# EAGLE board MAIN BOARD fat outline (EAGLE 5.11)
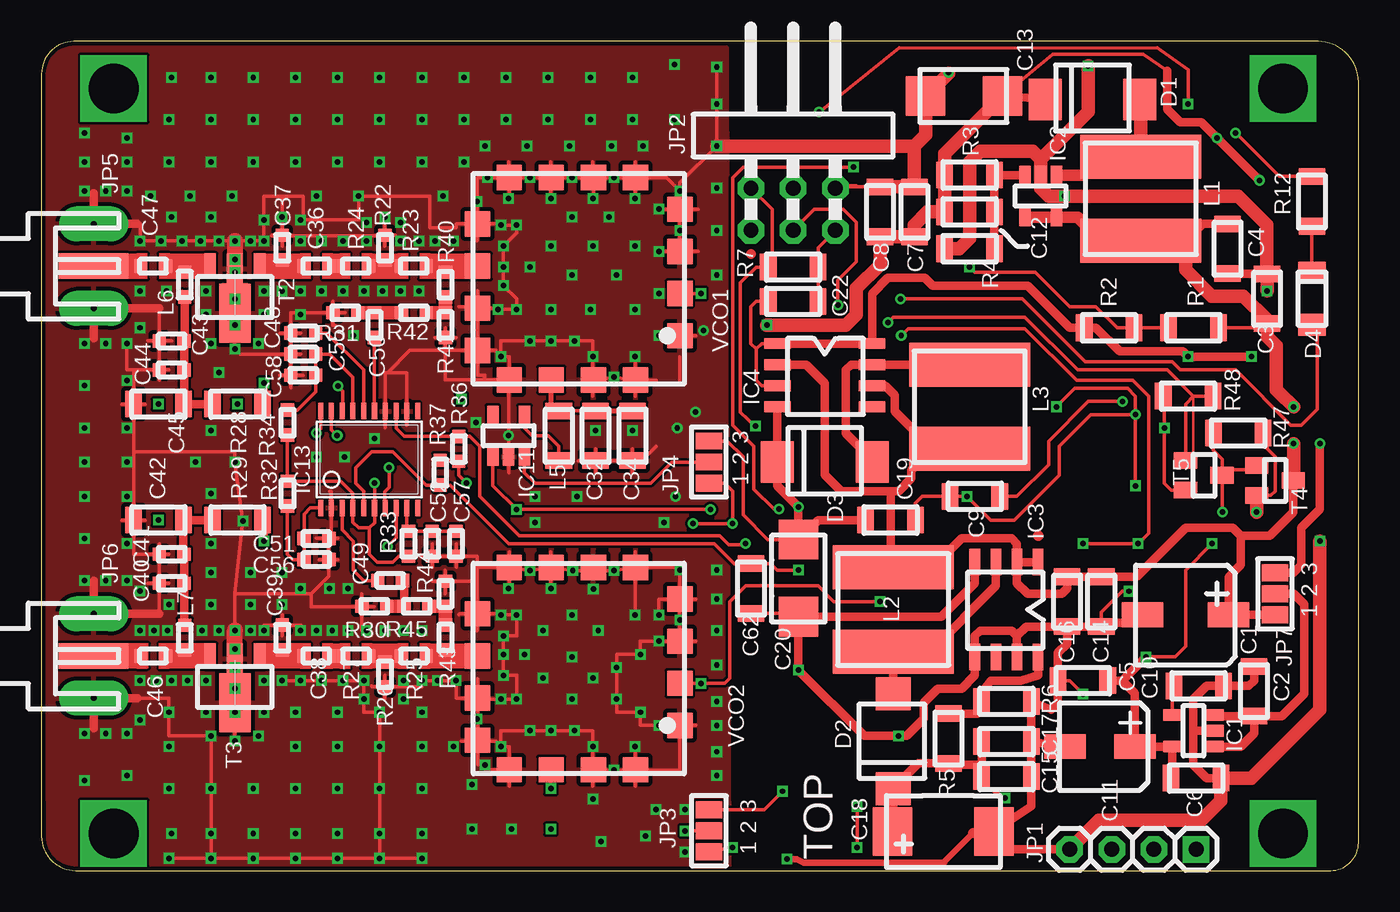
[diagram p2: board, top side]
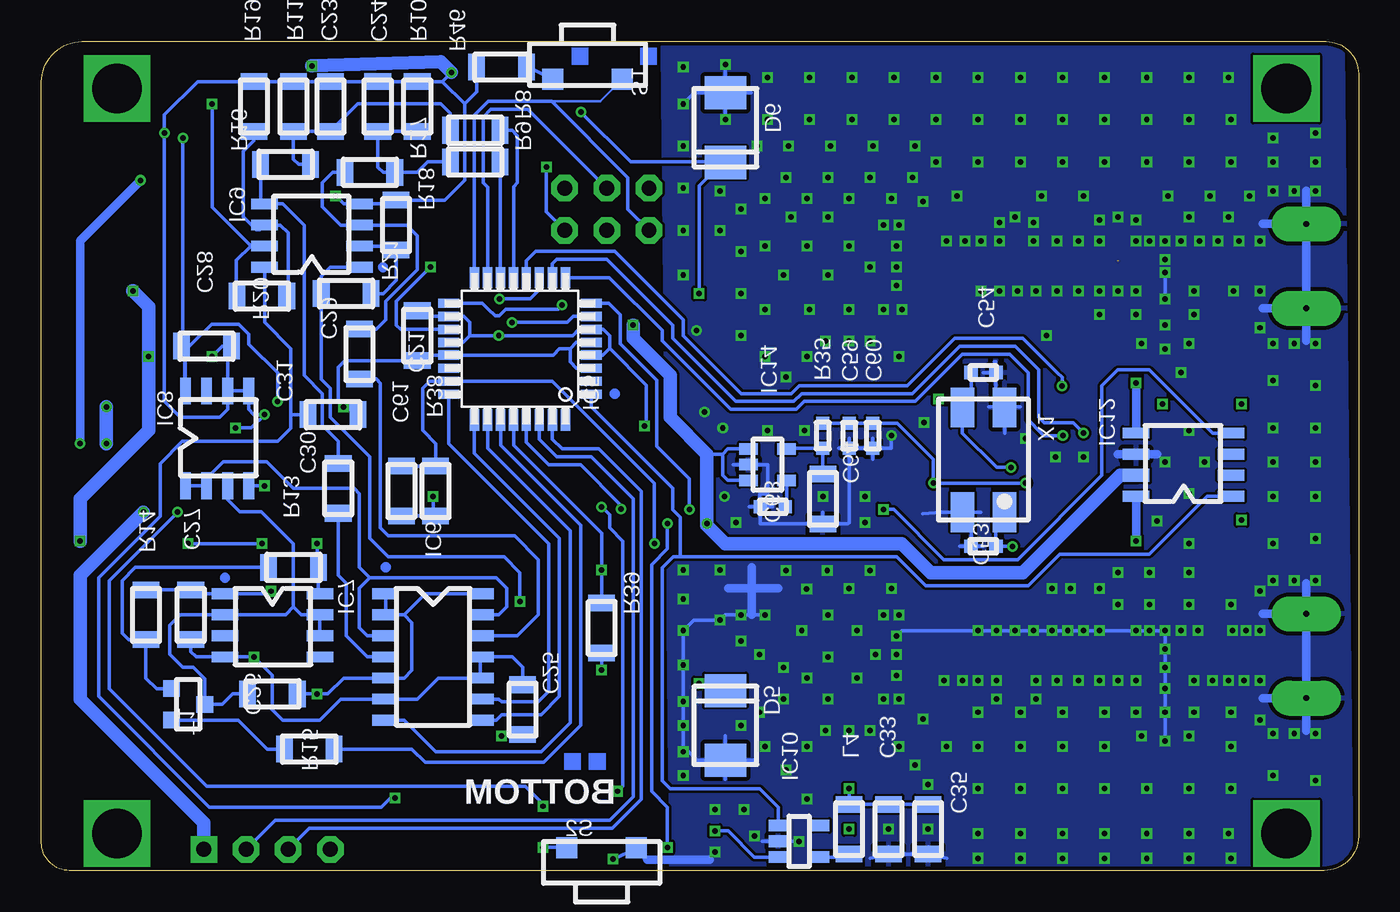
[diagram p3: board, bottom side, seen from below]

Size 79.39 x 49.97 mm. Coordinates in mm from the lower left corner, seen from the top.
Outline: 1.96,49.97 arc90 0,48.02 0,2.05 arc90 2.05,0 77.7,0 arc90 79.39,1.69 79.39,47.53 arc90 76.95,49.97 1.96,49.97
Copper layers (1*16): Top 0.035mm / dielectric 1.5mm / Bottom 0.035mm
Design rules "ITead_rule": minimum track width 6mil, minimum drill 12mil, track to track 6mil, track to pad 6mil, pad to pad 6mil, via to via 6mil, smd to smd 0mil, copper to edge 10mil, drill to drill 10mil, minimum pad ring 10mil, minimum via ring 6mil, stop-mask expansion 2mil, vias tented up to drill 100mil, thermal gap 10mil

## Footprints (pad centres in the part's own frame; a part is rotated, then mirrored left to right if it is on the bottom)
C1 = smd 1.5 x 2.5: 1 0,-2.594; 2 0,2.594
C2 = smd 1 x 1.6: 1 -1.5,0; 2 1.5,0
C3 = smd 1 x 1.6: 1 -1.5,0; 2 1.5,0
C4 = smd 1 x 1.6: 1 1.5,0; 2 -1.5,0
C5 = smd 1.6 x 1: 1 0,-1.5; 2 0,1.5
C6 = smd 1.6 x 1: 1 0,1.5; 2 0,-1.5
C7 = smd 1 x 1.6: 1 -1.5,0; 2 1.5,0
C8 = smd 1 x 1.6: 1 -1.5,0; 2 1.5,0
C9 = smd 1.6 x 1: 1 0,-1.5; 2 0,1.5
C10 = smd 1.6 x 1: 1 0,1.5; 2 0,-1.5
C11 = smd 1.5 x 2.5: 1 0,-1.865; 2 0,2.341
C12 = smd 1.6 x 1: 1 0,1.5; 2 0,-1.5
C13 = smd 2.388 x 2.388: 1 0,-2.311; 2 0,2.337
C14 = smd 1 x 1.6: 1 1.5,0; 2 -1.5,0
C15 = smd 1.6 x 1: 1 0,1.5; 2 0,-1.5
C16 = smd 1 x 1.6: 1 1.5,0; 2 -1.5,0
C17 = smd 1.6 x 1: 1 0,1.5; 2 0,-1.5
C18 = smd 2.896 x 2.388: 1 0,3.048; 2 0,-3.048
C19 = smd 1.6 x 1: 1 0,1.5; 2 0,-1.5
C20 = smd 2.388 x 2.388: 1 2.311,0; 2 -2.337,0
C21 = smd 1 x 1.6 bottom: 1 1.5,0; 2 -1.5,0
C22 = smd 1.6 x 1: 1 0,-1.5; 2 0,1.5
C23 = smd 1 x 1.6 bottom: 1 1.5,0; 2 -1.5,0
C24 = smd 1 x 1.6 bottom: 1 -1.5,0; 2 1.5,0
C25 = smd 1 x 1.6 bottom: 1 1.5,0; 2 -1.5,0
C26 = smd 1.6 x 1 bottom: 1 0,-1.5; 2 0,1.5
C27 = smd 1 x 1.6 bottom: 1 -1.5,0; 2 1.5,0
C28 = smd 1.6 x 1 bottom: 1 0,-1.5; 2 0,1.5
C29 = smd 1 x 1.6 bottom: 1 -1.5,0; 2 1.5,0
C30 = smd 1 x 1.6 bottom: 1 -1.5,0; 2 1.5,0
C31 = smd 1.6 x 1 bottom: 1 0,-1.5; 2 0,1.5
C32 = smd 1 x 1.6: 1 1.5,0; 2 -1.5,0
C33 = smd 1 x 1.6 bottom: 1 1.5,0; 2 -1.5,0
C34 = smd 1 x 1.6: 1 1.5,0; 2 -1.5,0
C35 = smd 1 x 1.6 bottom: 1 1.5,0; 2 -1.5,0
C36 = smd 0.8 x 0.8: 1 0,-0.75; 2 0,0.75
C37 = smd 0.8 x 0.8: 1 -0.75,0; 2 0.75,0
C38 = smd 0.8 x 0.8: 1 0,-0.75; 2 0,0.75
C39 = smd 0.8 x 0.8: 1 -0.75,0; 2 0.75,0
C40 = smd 0.8 x 0.8: 1 0,0.75; 2 0,-0.75
C41 = smd 0.8 x 0.8: 1 0,0.75; 2 0,-0.75
C42 = smd 1.6 x 1: 1 0,1.5; 2 0,-1.5
C43 = smd 0.8 x 0.8: 1 0,-0.75; 2 0,0.75
C44 = smd 0.8 x 0.8: 1 0,-0.75; 2 0,0.75
C45 = smd 1.6 x 1: 1 0,-1.5; 2 0,1.5
C46 = smd 0.8 x 0.8: 1 0,-0.75; 2 0,0.75
C47 = smd 0.8 x 0.8: 1 0,-0.75; 2 0,0.75
C48 = smd 0.8 x 0.8: 1 0,0.75; 2 0,-0.75
C49 = smd 0.8 x 0.8: 1 0,-0.75; 2 0,0.75
C50 = smd 0.8 x 0.8: 1 0.75,0; 2 -0.75,0
C51 = smd 0.8 x 0.8: 1 0,-0.75; 2 0,0.75
C52 = smd 0.8 x 0.8: 1 -0.75,0; 2 0.75,0
C53 = smd 0.8 x 0.8 bottom: 1 0,0.75; 2 0,-0.75
C54 = smd 0.8 x 0.8 bottom: 1 0,0.75; 2 0,-0.75
C55 = smd 0.8 x 0.8: 1 0,0.75; 2 0,-0.75
C56 = smd 0.8 x 0.8: 1 0,-0.75; 2 0,0.75
C57 = smd 0.8 x 0.8: 1 -0.75,0; 2 0.75,0
C58 = smd 0.8 x 0.8: 1 0,0.75; 2 0,-0.75
C59 = smd 0.8 x 0.8 bottom: 1 -0.75,0; 2 0.75,0
C60 = smd 0.8 x 0.8 bottom: 1 -0.75,0; 2 0.75,0
C61 = smd 1 x 1.6 bottom: 1 1.5,0; 2 -1.5,0
C62 = smd 1 x 1.6: 1 1.5,0; 2 -1.5,0
C63 = smd 0.8 x 0.8 bottom: 1 0,-0.75; 2 0,0.75
C64 = smd 1 x 1.6 bottom: 1 1.5,0; 2 -1.5,0
D1 = smd 2.5 x 2: 1 0,-2.856; 2 0,2.859
D2 = smd 2 x 2.1: 1 2.856,0; 2 -2.859,0
D3 = smd 2.5 x 2: 1 0,-2.856; 2 0,2.859
D4 = smd 1.315 x 1.68: 1 -1.568,0; 2 1.568,0
D5 = smd 2 x 2.5 bottom: 1 -2.1,0; 2 2.1,0
D6 = smd 2 x 2.5 bottom: 1 2.1,0; 2 -2.1,0
IC1 = smd 0.7 x 1.1: 1 -0.953,-1.27; 2 -0.001,-1.27; 3 0.951,-1.27; 4 0.952,1.27; 5 -0.954,1.27
IC2 = smd 1.1 x 0.7: 1 1.27,-0.953; 2 1.27,-0.001; 3 1.27,0.951; 4 -1.27,0.952; 5 -1.27,-0.954
IC3 = smd 1.6 x 0.65: 1 0,0; 2 0,1.27; 3 0,2.54; 4 0,3.81; 5 -5.715,3.81; 6 -5.715,2.54; 7 -5.715,1.27; 8 -5.715,0
IC4 = smd 0.65 x 1.6: 1 0,0; 2 -1.27,0; 3 -2.54,0; 4 -3.81,0; 5 -3.81,-5.715; 6 -2.54,-5.715; 7 -1.27,-5.715; 8 0,-5.715
IC5 = smd 0.559 x 1.27 bottom: 1 -2.743,4.293; 2 -1.956,4.293; 3 -1.168,4.293; 4 -0.381,4.293; 5 0.381,4.293; 6 1.168,4.293; 7 1.956,4.293; 8 2.743,4.293; 17 2.743,-4.293; 18 1.956,-4.293; 19 1.168,-4.293; 20 0.381,-4.293; 21 -0.381,-4.293; 22 -1.168,-4.293; 23 -1.956,-4.293; 24 -2.743,-4.293 | smd 1.27 x 0.559 bottom: 9 4.293,2.743; 10 4.293,1.956; 11 4.293,1.168; 12 4.293,0.381; 13 4.293,-0.381; 14 4.293,-1.168; 15 4.293,-1.956; 16 4.293,-2.743; 25 -4.293,-2.743; 26 -4.293,-1.956; 27 -4.293,-1.168; 28 -4.293,-0.381; 29 -4.293,0.381; 30 -4.293,1.168; 31 -4.293,1.956; 32 -4.293,2.743
IC6 = smd 0.65 x 1.6 bottom: 1 0,0; 2 -1.27,0; 3 -2.54,0; 4 -3.81,0; 5 -5.08,0; 6 -6.35,0; 7 -7.62,0; 8 -7.62,5.715; 9 -6.35,5.715; 10 -5.08,5.715; 11 -3.81,5.715; 12 -2.54,5.715; 13 -1.27,5.715; 14 0,5.715
IC7 = smd 0.65 x 1.6 bottom: 1 0,0; 2 -1.27,0; 3 -2.54,0; 4 -3.81,0; 5 -3.81,5.715; 6 -2.54,5.715; 7 -1.27,5.715; 8 0,5.715
IC8 = smd 1.6 x 0.65 bottom: 1 0,0; 2 0,1.27; 3 0,2.54; 4 0,3.81; 5 5.715,3.81; 6 5.715,2.54; 7 5.715,1.27; 8 5.715,0
IC9 = smd 0.65 x 1.6 bottom: 1 0,0; 2 1.27,0; 3 2.54,0; 4 3.81,0; 5 3.81,-5.715; 6 2.54,-5.715; 7 1.27,-5.715; 8 0,-5.715
IC10 = smd 0.7 x 1.1 bottom: 1 0.953,-1.27; 2 0.001,-1.27; 3 -0.951,-1.27; 4 -0.952,1.27; 5 0.954,1.27
IC11 = smd 1.1 x 0.7: 1 -1.27,0.953; 2 -1.27,0.001; 3 -1.27,-0.951; 4 1.27,-0.952; 5 1.27,0.954
IC12 = smd 0.65 x 1.6 bottom: 1 0,0; 2 1.27,0; 3 2.54,0; 4 3.81,0; 5 3.81,-5.715; 6 2.54,-5.715; 8 0,-5.715 | smd 0.8 x 1.6 bottom: 7 1.27,-5.715
TSSOP20 = smd 0.305 x 0.991: 1 -2.925,-2.918; 2 -2.275,-2.918; 3 -1.625,-2.918; 4 -0.975,-2.918; 5 -0.325,-2.918; 6 0.325,-2.918; 7 0.975,-2.918; 8 1.625,-2.918; 9 2.275,-2.918; 10 2.925,-2.918; 11 2.925,2.918; 12 2.275,2.918; 13 1.625,2.918; 14 0.975,2.918; 15 0.325,2.918; 16 -0.325,2.918; 17 -0.975,2.918; 18 -1.625,2.918; 19 -2.275,2.918; 20 -2.925,2.918
IC14 = smd 0.7 x 1.1 bottom: 1 0.95,-1.15; 2 0.001,-1.15; 3 -0.95,-1.15; 4 -0.95,1.15; 5 0.95,1.15
JP1 = drill 0.9 pad 1.6 square: 1 0,0 | drill 0.9 pad 1.6 octagon: 2 0,2.54; 3 0,5.08; 4 0,7.62
JP2 = drill 0.9 pad 1.6 octagon: 1 0,0; 2 2.54,0; 3 0,-2.54; 4 2.54,-2.54; 5 0,-5.08; 6 2.54,-5.08
JP3 = smd 1.016 x 1.6: 1 -1.27,0; 2 0,0; 3 1.27,0
JP4 = smd 1.016 x 1.6: 1 -1.27,0; 2 0,0; 3 1.27,0
JP5 = drill 0.356 pad 2.096 long: 1 -2.54,-2.286; 3 2.54,-2.286 | smd 1.524 x 4.191: 2 0,-2.286
JP7 = smd 1.016 x 1.6: 1 -1.27,0; 2 0,0; 3 1.27,0
L1 = smd 2.65 x 7.3: 1 0,0; 2 5.08,0
L2 = smd 2.65 x 7.3: 1 0,0; 2 -5.08,0
L3 = smd 2.65 x 7.3: 1 0,0; 2 5.08,0
L4 = smd 1 x 1.6 bottom: 1 1.5,0; 2 -1.5,0
L5 = smd 1 x 1.6: 1 1.5,0; 2 -1.5,0
L6 = smd 0.8 x 0.8: 1 0.75,0; 2 -0.75,0
L7 = smd 0.8 x 0.8: 1 -0.75,0; 2 0.75,0
R1 = smd 1.6 x 1: 1 0,-1.5; 2 0,1.5
R2 = smd 1.6 x 1: 1 0,-1.5; 2 0,1.5
R3 = smd 1.6 x 1: 1 0,1.5; 2 0,-1.5
R4 = smd 1.6 x 1: 1 0,-1.5; 2 0,1.5
R5 = smd 1 x 1.6: 1 -1.5,0; 2 1.5,0
R6 = smd 1.6 x 1: 1 0,1.5; 2 0,-1.5
R7 = smd 1.6 x 1: 1 0,1.5; 2 0,-1.5
R8 = smd 1.6 x 1 bottom: 1 0,1.5; 2 0,-1.5
R9 = smd 1.6 x 1 bottom: 1 0,1.5; 2 0,-1.5
R10 = smd 1 x 1.6 bottom: 1 -1.5,0; 2 1.5,0
R11 = smd 1 x 1.6 bottom: 1 1.5,0; 2 -1.5,0
R12 = smd 1 x 1.6: 1 1.5,0; 2 -1.5,0
R13 = smd 1.6 x 1 bottom: 1 0,1.5; 2 0,-1.5
R14 = smd 1 x 1.6 bottom: 1 -1.5,0; 2 1.5,0
R15 = smd 1.6 x 1 bottom: 1 0,1.5; 2 0,-1.5
R16 = smd 1.6 x 1 bottom: 1 0,-1.5; 2 0,1.5
R17 = smd 1.6 x 1 bottom: 1 0,-1.5; 2 0,1.5
R18 = smd 1 x 1.6 bottom: 1 -1.5,0; 2 1.5,0
R19 = smd 1 x 1.6 bottom: 1 -1.5,0; 2 1.5,0
R20 = smd 1.6 x 1 bottom: 1 0,-1.5; 2 0,1.5
R21 = smd 1.6 x 1 bottom: 1 0,-1.5; 2 0,1.5
R22 = smd 0.8 x 0.8: 1 -0.75,0; 2 0.75,0
R23 = smd 0.8 x 0.8: 1 0,-0.75; 2 0,0.75
R24 = smd 0.8 x 0.8: 1 0,-0.75; 2 0,0.75
R25 = smd 0.8 x 0.8: 1 0,0.75; 2 0,-0.75
R26 = smd 0.8 x 0.8: 1 0.75,0; 2 -0.75,0
R27 = smd 0.8 x 0.8: 1 0,0.75; 2 0,-0.75
R28 = smd 1.6 x 1: 1 0,1.5; 2 0,-1.5
R29 = smd 1.6 x 1: 1 0,1.5; 2 0,-1.5
R30 = smd 0.8 x 0.8: 1 0,-0.75; 2 0,0.75
R31 = smd 0.8 x 0.8: 1 0,-0.75; 2 0,0.75
R32 = smd 0.8 x 0.8: 1 0.75,0; 2 -0.75,0
R33 = smd 0.8 x 0.8: 1 -0.75,0; 2 0.75,0
R34 = smd 0.8 x 0.8: 1 -0.75,0; 2 0.75,0
R35 = smd 0.8 x 0.8 bottom: 1 0.75,0; 2 -0.75,0
R36 = smd 0.8 x 0.8: 1 -0.75,0; 2 0.75,0
R37 = smd 0.8 x 0.8: 1 0.75,0; 2 -0.75,0
R38 = smd 1 x 1.6 bottom: 1 1.5,0; 2 -1.5,0
R39 = smd 1 x 1.6 bottom: 1 1.5,0; 2 -1.5,0
R40 = smd 0.8 x 0.8: 1 -0.75,0; 2 0.75,0
R41 = smd 0.8 x 0.8: 1 0.75,0; 2 -0.75,0
R42 = smd 0.8 x 0.8: 1 0,0.75; 2 0,-0.75
R43 = smd 0.8 x 0.8: 1 0.75,0; 2 -0.75,0
R44 = smd 0.8 x 0.8: 1 -0.75,0; 2 0.75,0
R45 = smd 0.8 x 0.8: 1 0,0.75; 2 0,-0.75
R46 = smd 1.6 x 1 bottom: 1 0,1.5; 2 0,-1.5
R47 = smd 1.6 x 1: 1 0,1.5; 2 0,-1.5
R48 = smd 1.6 x 1: 1 0,-1.5; 2 0,1.5
S1 = smd 1.27 x 1.27 bottom: 1 -0.885,2.1; 2 -0.885,-2.1
S2 = smd 1.27 x 1.27 bottom: 1 0.885,-2.1; 2 0.885,2.1
T1 = smd 1 x 1 bottom: 1 0.95,-1; 2 -0.95,-1; 3 0,1
T2 = smd 1.524 x 0.711: 1 2.2,-1.5; 3 2.2,1.5 | smd 1.85 x 0.965: 2 2.037,0 | smd 3.556 x 1.905: 4 -0.635,0
T3 = smd 1.524 x 0.711: 1 2.2,-1.5; 3 2.2,1.5 | smd 1.85 x 0.965: 2 2.037,0 | smd 3.556 x 1.905: 4 -0.635,0
T4 = smd 1 x 1.4: 1 0.9,1.111; 2 -0.9,1.111; 3 0,-1.089
T5 = smd 1 x 1.4: 1 0.9,1.111; 2 -0.9,1.111; 3 0,-1.089
VCO1 = smd 1.524 x 1.524: 1 0,0; 2 2.54,0; 3 5.08,0; 4 7.62,0; 5 9.525,2.667; 6 9.525,5.207; 7 9.525,7.747; 8 9.525,10.287; 9 6.731,12.192; 10 4.191,12.192; 11 1.651,12.192; 12 -0.889,12.192; 13 -2.667,10.287; 14 -2.667,7.747; 15 -2.667,5.207; 16 -2.667,2.667
VCO2 = smd 1.524 x 1.524: 1 0,0; 2 2.54,0; 3 5.08,0; 4 7.62,0; 5 9.525,2.667; 6 9.525,5.207; 7 9.525,7.747; 8 9.525,10.287; 9 6.731,12.192; 10 4.191,12.192; 11 1.651,12.192; 12 -0.889,12.192; 13 -2.667,10.287; 14 -2.667,7.747; 15 -2.667,5.207; 16 -2.667,2.667
X1 = smd 2.4 x 1.4 bottom: 1 0,0; 2 0,-2.54; 3 6.3,-2.54; 4 6.3,0

## Placement (x,y rotation side)
C1  100u/6.3V  [C1]  68.96,15.41 90 top
C2  100n  [C2]  73.09,10.81 90 top
C3  100n  [C3]  73.88,34.46 90 top
C4  1u  [C4]  71.5,37.48 90 top
C5  1u  [C5]  62.77,11.45 90 top
C6  100n  [C6]  69.6,5.57 90 top
C7  100n  [C7]  52.61,39.7 90 top
C8  1u  [C8]  50.55,39.7 90 top
C9  100n  [C9]  56.26,22.56 90 top
C10  10n  [C10]  69.76,11.13 90 top
C11  100u/4V  [C11]  64.04,7.48 90 top
C12  470p  [C12]  55.95,39.7 90 top
C13  100u/10V  [C13]  55.63,46.69 90 top
C14  1u  [C14]  63.88,16.21 90 top
C15  1u  [C15]  58.17,5.65 90 top
C16  100n  [C16]  61.82,16.21 90 top
C17  100n  [C17]  58.17,7.78 90 top
C18  22u/35V  [C18]  54.36,2.35 90 top
C19  100n  [C19]  51.18,21.13 90 top
C20  68u/16V  [C20]  45.63,17.64 90 top
C21  100n  [C21]  56.74,32.24 90 top
C22  100n  [C22]  45.31,34.3 90 top
C23  4.7u  [C23]  61.98,46.05 90 top
C24  4.7u  [C24]  59.12,46.05 90 top
C25  100n  [C25]  50.39,9.7 90 top
C26  100n  [C26]  65.47,10.65 90 top
C27  100n  [C27]  70.39,15.41 90 top
C28  100n  [C28]  69.44,31.61 90 top
C29  4.7u  [C29]  60.23,31.13 90 top
C30  4.7u  [C30]  61.5,23.03 90 top
C31  100n  [C31]  61.82,27.48 90 top
C32  100n  [C32]  33.4,26.21 90 top
C33  100n  [C33]  28.32,2.49 90 top
C34  1u  [C34]  35.62,26.21 90 top
C35  1u  [C35]  25.94,2.49 90 top
C36  68p  [C36]  16.57,36.43 90 top
C37  *  [C37]  14.51,37.54 90 top
C38  100p  [C38]  16.57,12.94 90 top
C39  *  [C39]  14.51,14.04 90 top
C40  68p  [C40]  7.84,17.32 90 top
C41  1000p  [C41]  7.84,19.07 90 top
C42  1u  [C42]  7.05,21.13 90 top
C43  22p  [C43]  7.84,31.92 90 top
C44  1000p  [C44]  7.84,30.18 90 top
C45  1u  [C45]  7.05,28.11 90 top
C46  100p  [C46]  6.73,12.94 90 top
C47  68p  [C47]  6.73,36.43 90 top
C48  100p  [C48]  15.78,32.4 90 top
C49  100p  [C49]  21.02,17.48 90 top
C50  100p  [C50]  20.07,32.88 90 top
C51  100p  [C51]  16.57,20.02 90 top
C52  100p  [C52]  23.56,19.7 90 top
C53  22p  [C53]  22.61,19.54 90 top
C54  22p  [C54]  22.61,30.02 90 top
C55  100p  [C55]  15.78,31.13 90 top
C56  10n  [C56]  16.57,18.75 90 top
C57  10n  [C57]  24.99,19.7 90 top
C58  10n  [C58]  15.78,29.86 90 top
C59  100n  [C59]  30.7,26.21 90 top
C60  1u  [C60]  29.27,26.21 90 top
C61  100n  [C61]  57.69,22.88 90 top
C62  100n  [C62]  42.77,17 90 top
C63  10n  [C63]  35.31,21.92 90 top
C64  1u  [C64]  32.29,22.4 90 top
D1  SS14  [D1]  63.36,46.49 90 top
D2  SS14  [D2]  51.34,7.79 90 top
D3  SS14  [D3]  47.21,24.62 90 top
D4  GREEN  [D4]  76.58,34.46 90 top
D5  SMAZ22-13-F  [D5]  38.16,8.75 90 top
D6  SMAZ22-13-F  [D6]  38.16,44.78 90 top
IC1  TPS79333  [IC1]  69.44,8.43 90 top
IC2  LM2731Y  [IC2]  60.23,40.66 90 top
IC3  LT1173CS8  [IC3]  60.07,18.59 90 top
IC4  LT1301CS8  [IC4]  44.36,31.77 90 top
IC5  ATMEGA168-10V  [IC5]  50.55,31.45 90 top
IC6  AD8402ARZ10  [IC6]  58.64,16.68 90 top
IC7  NE555D  [IC7]  68.33,16.68 90 top
IC8  LM358D  [IC8]  70.71,23.19 90 top
IC9  LM358D  [IC9]  60.23,36.37 90 top
IC10  MIC2514  [IC10]  33.72,1.76 90 top
IC11  MIC2514  [IC11]  28.16,26.21 90 top
IC12  MIC2506YM  [IC12]  7.69,22.56 90 top
IC13  LMX2433  [TSSOP20]  19.75,24.78 0 top
IC14  LP2985AIM5-2.5CT  [IC14]  35.62,24.46 90 top
JP1  USB/Batt Board  [JP1]  69.6,1.28 90 top
JP2  ISP  [JP2]  42.77,38.59 90 top
JP3  VCO voltage select  [JP3]  40.23,2.4 90 top
JP4  VCO Voltage select  [JP4]  40.23,24.62 90 top
JP5  SMA J629-ND  [JP5]  0.86,36.43 90 top
JP6  SMA J629-ND  [JP5]  0.86,12.94 90 top
JP7  3.3V supply select  [JP7]  74.36,16.68 90 top
L1  7.3uH  [L1]  66.26,37.96 90 top
L2  33uH  [L2]  51.34,18.27 90 top
L3  33uH  [L3]  55.95,25.41 90 top
L4  FERRIT  [L4]  30.7,2.49 90 top
L5  FERRIT  [L5]  31.18,26.21 90 top
L6  22nH  [L6]  8.64,35.32 90 top
L7  33nH  [L7]  8.64,14.04 90 top
R1  510K  [R1]  69.44,32.72 90 top
R2  330K  [R2]  64.36,32.72 90 top
R3  47K  [R3]  55.95,41.92 90 top
R4  13K  [R4]  55.95,37.48 90 top
R5  820K  [R5]  54.67,7.95 90 top
R6  50K  [R6]  58.17,10.2 90 top
R7  10K  [R7]  45.31,36.37 90 top
R8  1K  [R8]  53.25,44.62 90 top
R9  1K  [R9]  53.25,42.72 90 top
R10  *  [R10]  56.74,46.05 90 top
R11  *  [R11]  64.2,46.05 90 top
R12  750  [R12]  76.58,40.34 90 top
R13  10K  [R13]  64.2,18.27 90 top
R14  20K  [R14]  73.09,15.41 90 top
R15  68  [R15]  63.25,7.32 90 top
R16  10K  [R16]  64.68,42.56 90 top
R17  10K  [R17]  59.6,42.08 90 top
R18  10K  [R18]  58.01,38.91 90 top
R19  10K  [R19]  66.58,46.05 90 top
R20  30K(47K)  [R20]  66.11,34.62 90 top
R21  30K(47K)  [R21]  61.02,34.78 90 top
R22  *  [R22]  20.7,37.54 90 top
R23  0  [R23]  22.45,36.43 90 top
R24  0  [R24]  18.96,36.43 90 top
R25  0  [R25]  22.45,12.94 90 top
R26  *  [R26]  20.7,11.82 90 top
R27  0  [R27]  18.96,12.94 90 top
R28  1  [R28]  11.81,28.11 90 top
R29  1  [R29]  11.81,21.13 90 top
R30  50  [R30]  20.07,15.93 90 top
R31  50  [R31]  18.32,33.62 90 top
R32  18  [R32]  14.83,22.72 90 top
R33  18  [R33]  22.13,19.7 90 top
R34  18  [R34]  14.83,27 90 top
R35  18  [R35]  32.29,26.21 90 top
R36  10K  [R36]  25.15,25.41 90 top
R37  10K  [R37]  24.04,23.99 90 top
R38  10K  [R38]  55.63,22.88 90 top
R39  10K  [R39]  45.63,14.62 90 top
R40  10  [R40]  24.35,35.32 90 top
R41  120  [R41]  24.35,32.88 90 top
R42  10  [R42]  22.45,33.62 90 top
R43  22  [R43]  24.35,14.04 90 top
R44  47  [R44]  24.35,16.68 90 top
R45  22  [R45]  22.61,15.93 90 top
R46  100  [R46]  51.66,48.43 90 top
R47  100K  [R47]  72.14,26.37 90 top
R48  100K  [R48]  69.12,28.59 90 top
S1  Cycle Program  [S1]  46.48,48.59 90 top
S2  Power ON  [S2]  45.63,0.49 90 top
T1  MMBT3906  [T1]  70.55,10.02 90 top
T2  GALI-84 / SGA-7489Z  [T2]  11.65,34.23 90 top
T3  GALI-84 / SGA-7489Z  [T3]  11.65,10.74 90 top
T4  FDN302P  [T4]  74.36,23.51 90 top
T5  FDV303N  [T5]  70.07,23.83 90 top
VCO1  ROS-2700-1819  [VCO1]  38.48,32.24 90 top
VCO2  ROS-1300  [VCO2]  38.48,8.75 90 top
X1  10MHz  [X1]  21.34,21.61 90 top

## Tracks (layer width: path | path; a pad name or v marks a point on that pad's centre or on a via)
1  (via drill 0.33 pad 0.25)
  Top 0.2: T4.2 74.09,22.61 74.36,22.88 74.36,24.94 73.88,25.41 73.88,26.12 R47.2
  Top 0.8: v73.25,21.61 T4.2
  Bottom 0.8: JP1.1 69.6,2.87 77.06,10.33 77.06,17.8 v73.25,21.61
2
  Top 0.5: 63.88,43.04 L1.2 | 66.26,46.69 D1.1
  Top 0.7: IC2.1 62.77,41.92 63.88,43.04
  Top 0.8: L1.2 66.26,46.69
3
  Bottom 0.2: JP1.3 63.25,2.56 44.99,2.56 43.24,4.3 43.24,22.88 45.78,25.41 48.01,25.41 48.59,26 IC5.31
3.3V  (via drill 0.33)
  Top 0.2: v62.77,19.7 v66.11,19.7 66.74,20.34 66.74,28.59 65.79,29.54 62.39,29.54 59.28,32.66 52.24,32.66 v51.83,32.24 | v70.55,19.7 68.96,18.11 68.96,13.51 IC7.4 v66.58,12.87 | JP2.2 44.04,39.86 44.04,36.6 R7.1 43.09,36.37 42.13,35.42 42.13,27.63 v43.03,26.79
  Top 0.5: C6.1 68.17,5.64 IC1.5 C11.1 65.91,10.69 65.15,11.45 | 65.15,11.45 C5.1 | v66.58,12.87 65.15,11.45
  Bottom 0.2: IC5.4 45.56,31.07 45.15,31.48 | 45.15,31.48 45.15,32.24 45.52,32.62 IC5.6 47,32.62 47.37,32.24 v51.83,32.24 53.56,32.24 | IC5.20 53.98,31.83 53.56,32.24 | 53.56,32.24 53.56,33.04 53.93,33.4 IC5.18 56.4,33.4 C21.1 | v62.77,19.7 62.77,18.34 R13.1 62.7,16.77 IC7.8 | v70.55,19.7 v66.11,19.7 | C25.1 50.39,12.24 51.02,12.87 IC6.11 IC6.10 55.47,11.6 56.74,10.33 IC6.6 61.34,10.33 62.61,9.06 64.84,9.06 65.47,9.7 65.47,11.76 v66.58,12.87 IC7.4 70.07,12.87 70.39,13.19 C27.1 | 45.15,31.48 42.93,29.26 42.93,26.89 v43.03,26.79
  Bottom 0.5: IC5.20
5V  (via drill 0.33, 0.33 pad 0.25)
  Top 0.2: v65.15,28.27 63.09,28.27 60.71,25.89 60.71,24.46 58.8,22.56 C9.1 | JP4.1 41.18,23.35 41.66,22.88 v41.66,20.91 v39.28,20.91 | v41.66,1.39 JP3.1 | C13.1 60.95,49.2 66.42,49.2 67.85,48.22
  Top 0.5: v77.06,25.73 77.06,21.76 75.95,20.65 75.95,18.43 75.47,17.95 JP7.3 | C13.1 D1.2 | 67.85,48.22 67.85,45.89 68.64,45.1 69.91,45.1 v70.87,44.15 v73.41,41.61
  Top 0.8: v43.72,32.88 48.48,32.88 49.12,33.51 49.12,35.1 50.55,36.53 C8.1 C7.1 52.61,38.91 53.41,39.7 C12.1 R3.1 54.45,43.19 C13.1
  Bottom 0.2: IC14.3 38.01,23.51 38.32,23.83 38.32,25.1 | 38.32,25.1 38.01,25.41 IC14.1 | 39.28,25.1 38.32,25.1 | v41.66,20.91 41.66,19.38 42.61,18.43 42.61,4.78 41.66,3.83 v41.66,1.39 | 70.94,44.08 v70.87,44.15 70.87,32.31 70.74,32.18 70.74,28.94 IC8.8 70.71,31.36 70.47,31.61 | v65.15,28.27 65.15,30 66.89,31.73 66.89,32.33 67.49,32.93 69.14,32.93 70.47,31.61 | 70.47,31.61 C28.1
  Bottom 0.5: v77.06,25.73 77.06,37.96 v73.41,41.61
  Bottom 0.8: v43.72,32.88 43.72,32.08 41.5,29.86 41.5,27.32 39.28,25.1 v39.28,20.91 39.28,20.81 38.16,19.7 27.53,19.7 25.78,17.95 20.23,17.95 14.35,23.83 IC12.7
12V  (via drill 0.33)
  Top 0.2: C20.1 43.79,19.95 42.29,21.45 42.29,24.94 41.34,25.89 JP4.3 | v44.67,4.78 43.56,3.67 JP3.3
  Top 0.5: IC4.4 D3.2 44.35,23.19 v45.63,21.92 C20.1 46.81,21.13 C19.1
  Bottom 0.2: v45.63,21.92 45.15,21.45 45.15,20.65 44.36,19.86 44.36,5.1 v44.67,4.78
24V  (via drill 0.33)
  Top 0.2: v58.09,4.38 56.74,5.18 C15.1
  Top 0.5: 56.67,6.37 C15.1 | C18.1 51.34,1.63 D2.2 52.86,6.45 R5.1 54.76,6.37 56.67,6.37 | 56.67,6.37 C17.1
  Bottom 0.2: 64.36,27.48 C31.1 | 64.36,27.48 64.36,31.45 65.95,33.04 IC9.8 | v58.09,4.38 58.35,4.38 58.9,3.82 69.28,3.83 75.95,10.49 75.95,17.64 72.24,21.34 72.24,24.53 70.89,25.88 65.14,25.88 64.36,26.66 64.36,27.48
+
  Bottom 0.2: C30.2 61.5,25.89 62.45,26.84 62.45,28.75 63.56,29.86 63.56,38.91 64.84,40.18 IC9.5 66.18,40.41 R16.1
BYPASS
  Top 0.2: IC1.4 68.17,11.04 C10.1
CLK
  Bottom 0.2: IC6.9 51.82,10.33 51.66,10.18 49.44,10.18 48.8,10.81 48.8,19.7 54.84,25.74 IC5.24
CPOUTRF  (via drill 0.33)
  Top 0.2: IC13.13 21.38,26.65 21.86,26.16 R36.2 25.83,26.16 26.42,25.57 26.42,22.56 28.8,20.18 40.9,20.18 41.44,19.63 42.38,19.63 v42.45,19.7
  Bottom 0.2: C61.1 R38.1 55.63,25.73 56.42,26.53 56.42,29.07 56,29.49 IC5.23 48.59,29.49 42.45,23.35 v42.45,19.7
CS  (1 unrouted)
  Bottom 0.2: IC6.7 57.53,9.06 55.63,7.16 49.28,7.16 47.53,8.9 47.53,20.49 52.5,25.47 IC5.26
CTLA
  Bottom 0.2: IC5.1 46.26,27.95 41.34,23.03 41.34,21.73 40.89,21.28 40.89,18.91 | IC10.1 34.99,3.83 36.1,4.94 41.5,4.94 41.98,5.41 41.98,18.25 41.32,18.91 40.89,18.91 | IC12.1 9.11,22.56 12.61,19.07 18,19.07 19.91,17.16 26.1,17.16 27.85,18.91 40.89,18.91
  Bottom 0.406: IC10.1
CTLB  (via drill 0.33)
  Top 0.2: v40.33,21.76 v28.64,21.76 27.21,23.19 IC11.1
  Bottom 0.2: IC5.8 45.19,34.19 44.52,33.51 44.52,31.77 42.29,29.54 42.29,25.57 40.33,23.61 v40.33,21.76 | IC12.4 8.8,26.37 12.61,30.18 14.51,30.18 15.46,29.22 15.46,23.83 20.54,18.75 24.99,18.75 28,21.76 v28.64,21.76
DATA  (via drill 0.33)
  Top 0.2: v16.57,26.37 16.82,26.62 IC13.20
  Bottom 0.2: IC5.10 48.59,36.58 48.32,36.84 45.31,36.84 41.34,32.88 41.34,32.08 37.53,28.27 34.04,28.27 33.56,28.75 26.89,28.75 24.04,31.61 20.7,31.61 19.27,30.18 19.27,27.32 18.96,27 17.21,27 v16.57,26.37
  Bottom 0.5: IC5.10
FB
  Top 0.5: R4.1 C12.2 R3.2 IC2.3
FINRF#
  Top 0.2: IC13.16 19.43,30.18 17.21,32.4 C48.2
G  (via drill 0.33, 0.33 pad 0.25)
  Top 0.2: 73.32,24.48 T4.1 72.98,24.14 71.48,24.14 T5.3 71.19,23.8 | v49.16,1.39 v49.16,3.88 | v71.19,21.61 71.19,23.63 71.19,23.8 | 71.19,23.8 71.19,24.78 70.64,25.33 R47.1
  Top 0.406: T5.3 71.16,23.63 71.19,23.63
  Bottom 0.2: S2.1 47.79,1.44 47.84,1.39 v49.16,1.39 | v71.19,21.61 75.31,17.48 75.31,10.97 69.44,5.1 50.23,5.1 49.16,4.03 v49.16,3.88
GND  (via drill 0.33, 0.33 pad 0.25)
  Top 0.152: 54.43,0.47 54.43,0.54 | JP2.6 47.85,41.29 49.12,41.29 49.12,41.2
  Top 0.2: C19.2 52.68,22.15 53.09,22.56 C9.2 v55.79,22.56 57.21,21.13 58.64,21.13 61.34,23.83 61.34,25.57 63.25,27.48 v65.95,27.48 | IC4.1 43.4,31.77 43.09,31.45 | 43.09,31.45 43.09,29.54 43.4,29.22 IC4.3 | C62.2 45.42,15.5 C20.2 | v62.77,10.65 61.98,11.45 C5.2 | v65.95,27.48 v65.95,23.19 | 26.29,9.06 26.26,9.06 | v27.69,7.48 27.69,8.43 v29.43,8.43 v30.7,8.43 v32.13,8.43 33.24,8.43 v33.24,7.48 33.24,6.08 | 33.24,6.08 VCO2.15 33.24,6.05 | 35.82,6.05 VCO2.16 35.78,6.05 | 35.78,6.05 v34.51,6.05 33.24,6.05 | 35.78,6.05 v35.78,7.48 | 35.82,6.05 38.48,6.05 VCO2.1 | VCO2.1 v37.21,8.75 36.1,8.75 v36.1,9.54 34.67,9.54 v34.67,10.33 v34.67,12.24 34.67,13.03 v36.1,13.03 36.1,13.83 v37.21,13.83 VCO2.3 | VCO2.3 v38.48,15.1 VCO2.4 | 26.26,18.27 VCO2.8 | 30.7,18.27 v30.7,17 | VCO2.8 28.2,17 | 26.26,15.48 27.69,15.48 v27.69,15.41 v28.64,15.41 28.64,14.14 v27.85,14.14 v27.85,13.03 v27.85,11.76 28.64,11.76 v28.64,10.33 v27.69,10.33 26.42,10.33 | 35.78,18.27 v35.78,15.41 | VCO2.4 37.21,16.37 v37.21,15.41 | VCO2.5 35.78,18.59 | 26.29,32.56 VCO1.12 | VCO1.12 26.29,29.86 26.73,29.86 26.73,29.57 | 26.29,32.56 26.26,32.56 | 33.24,29.57 v33.24,30.97 33.24,31.92 v32.13,31.92 v30.7,31.92 v29.43,31.92 27.69,31.92 v27.69,30.97 28.2,30.97 VCO1.13 | 33.24,29.57 VCO1.15 33.24,29.54 | 35.82,29.54 VCO1.16 35.78,29.54 | 35.78,29.54 v34.51,29.74 33.24,29.54 | 35.78,29.54 v35.78,30.97 | 35.82,29.54 37.05,29.54 | 38.48,29.54 38.48,30.97 | v37.21,32.24 VCO1.1 39.44,32.24 | VCO1.3 v37.21,37.32 | VCO1.4 v38.48,38.59 VCO1.3 | VCO1.6 33.28,40.5 | 30.7,41.77 v30.7,40.5 | VCO1.8 28.2,40.5 v28.16,40.5 | 26.26,38.97 27.69,38.97 v27.69,38.91 v28.64,38.91 28.64,38.43 v27.85,37.64 v27.85,36.37 v27.85,35.26 28.64,34.46 v28.64,33.83 v27.53,33.83 27.53,33.89 VCO1.11
  Top 0.2: 35.78,41.77 v35.78,40.5 | VCO1.4 v37.21,39.86 | 35.78,42.08 VCO1.5 | 35.78,6.05 35.82,6.05 | 35.78,18.27 v34.51,18.07 v32.02,18.07 30.7,18.27 | 30.7,18.27 v29.43,18.07 VCO2.8 | 35.78,29.54 35.82,29.54 | VCO1.6 v34.51,41.77 35.78,41.77 | VCO1.8 v29.43,41.77 30.7,41.77 | 26.26,38.97 v26.26,40.34 26.26,41.77 v26.89,41.77 28.16,41.77 | IC11.2 | 28.16,29.54 27.69,29.07 | 37.05,25.57 36.19,24.71 C34.2 | C32.2 C34.2 | VCO2.11 26.2,10.49 | C32.2 33.4,25.41 | C32.2 33.4,23.99 | C32.2 32.36,24.71 | C34.2 35.62,25.41 | C34.2 35.62,23.99 | v27.69,7.48 28.2,7.48 VCO2.13 | VCO2.13 26.73,6.08 v26.73,6.37 26.29,6.37 26.29,7.79 | VCO2.8 28.2,19.22 | 30.7,18.27 30.7,19.22 | 35.78,18.27 VCO2.5 | 35.78,18.27 35.78,18.59 | VCO2.4 39.44,16.37 | VCO2.3 39.44,13.83 | VCO2.1 39.44,8.75 | 35.78,6.05 35.78,5.1 | 33.24,6.08 33.24,6.05 | VCO2.13 28.2,5.1 | 26.29,9.06 26.29,7.79 | 26.29,7.79 27.37,7.79 v27.69,7.48 | 26.29,7.79 25.31,7.79 | 26.73,29.57 VCO1.13 | VCO1.12 27.37,31.35 27.37,31.29 | 26.26,38.97 24.99,38.97 24.99,38.75 23.4,38.75 23.4,40.66 v19.11,40.66 19.11,39.23 15.78,39.23 15.78,40.66 14.51,40.66 | 28.16,41.77 28.16,42.72 | 28.16,41.77 VCO1.8 | 30.7,41.77 30.7,42.72 | 33.24,41.77 33.24,42.72 | 33.24,41.77 VCO1.6 | 35.78,41.77 35.78,42.08 | 35.78,41.77 VCO1.5 | VCO1.4 39.59,39.86 | VCO1.3 39.59,37.32 | 33.24,29.57 33.24,29.54 | 35.78,29.54 35.78,28.59 | IC11.2 28.16,23.99 | 30.7,41.77 v31.97,41.77 33.24,41.77 | 35.78,18.59 35.78,19.22 | 33.24,6.05 33.24,5.1 | 35.78,42.08 35.78,42.72 | 33.24,29.54 33.24,28.59 | v20.38,0.74 v22.93,0.74 | v20.38,0.74 v17.84,0.74 v15.3,0.74 v12.77,0.74 v10.22,0.74 | v7.69,0.74 v10.22,0.74 | v14.51,11.45 v15.62,11.45 v16.89,11.45 v18.16,11.45 v19.43,11.45 v19.43,10.33 19.43,9.54 v20.38,9.54 v20.38,7.48 v20.38,4.94 v20.38,2.24 v20.38,0.74
  Top 0.2: 26.29,33.99 25.15,33.99 | VCO1.11 26.29,33.99 | VCO1.11 26.29,32.56 | C14.2 63.88,15.57 65.14,16.83 v65.54,16.83 | v71.98,44.46 74.61,41.84 R12.1 | 28.16,29.54 v28.16,26.21 IC11.2 | 14.51,40.66 v14.51,39.38 C37.2 | C37.2 13.88,38.29 13.88,38.27 14.51,38.27 | C37.2 14.51,38.27 | 14.51,38.27 14.51,37.64 | 26.26,38.97 26.26,37.96 | 26.29,33.99 26.29,34.94 | C43.2 7.09,33.89 | C44.2 C43.2 | 5.55,30.18 C44.2 | C45.2 5.55,30.18 | C42.1 5.55,19.07 C41.1 | C41.1 C40.1 | C40.1 7.09,15.48 | C43.2 6.42,31.92 | C43.2 7.84,31.92 | C44.2 7.09,29.54 | C44.2 7.69,30.18 | C45.2 4.83,28.11 | C45.2 6.26,28.11 | C42.1 4.83,21.13 | C42.1 6.26,21.13 | C41.1 7.09,19.7 | C41.1 7.69,19.07 | C40.1 6.42,17.32 | C40.1 7.69,17.32 | 5.78,38.97 5.94,38.97 v5.94,37.96 v7.21,37.96 v8.48,37.96 v9.59,37.96 v10.7,37.96 v11.65,37.96 v12.61,37.96 v13.4,37.96 v13.4,39.23 13.4,40.66 14.51,40.66 | 5.55,30.18 5.14,30.18 v5.14,31.77 | v11.65,36.84 v11.65,36.06 | v11.65,34.46 v11.65,32.88 v11.65,31.45 11.97,31.13 C55.1 | 5.55,25.26 C45.2 | 5.55,25.26 C42.1 | 26.42,10.33 VCO2.11 | VCO2.11 24.99,10.4 v24.99,11.45 v23.88,11.45 v22.93,11.45 22.93,11.07 R26.2 | v11.65,7.79 v11.65,9.54 T3.4 v11.65,10.97 v11.65,12.24 T3.2 | v13.4,14.46 13.4,14.79 C39.2 | v15.62,14.46 15.62,14.79 | C39.2 14.51,15.41 | v10.22,0.74 v10.22,2.24 v10.22,4.94 v10.22,8.11 7.69,8.11 v7.69,9.54 7.69,10.4 5.78,10.4 | 26.26,15.48 26.26,14.46 | 5.55,25.26 11.65,25.26 v11.65,24.62 v12.14,21.08 11.65,16.68 | 26.29,10.33 26.29,9.06 | VCO1.13 28.16,29.54 | C39.2 14.51,14.14 | 26.42,10.33 26.29,10.33 | 43.09,31.45 42.77,31.77 42.77,33.99 43.09,34.3 C22.2 | C8.2 49.12,41.2 47.92,41.2 JP2.6 | C55.1 C48.1 | C55.1 C58.1 | C57.1 C52.1
  Top 0.2: C51.1 17.48,20.17 IC13.2 17.48,22.88 17.37,22.88 | C56.1 C51.1 | C56.1 17.32,17.75 16.26,16.68 | VCO1.12 22.2,31.35 20.86,30.02 | v11.65,14.46 11.65,16.68 | C58.1 15.03,29.11 | C58.1 14.35,29.86 | C58.1 15.78,29.86 | C55.1 15.62,31.13 | C48.1 14.35,32.4 | C48.1 15.62,32.4 | 20.86,30.02 22.02,30.02 IC13.12 22.02,26.84 | 20.86,30.02 20.72,30.02 IC13.14 20.72,26.68 | C51.1 16.57,20.02 | C51.1 17.84,20.02 | C56.1 17.84,18.75 | C56.1 16.73,18.75 | VCO2.4 v38.48,18.11 38.32,18.27 VCO2.5 | 26.26,15.48 25.21,15.48 25.15,15.41 | R44.2 23.56,17.43 | R44.2 24.35,16.68 | R44.2 24.35,18.11 | 15.62,14.79 C39.2 | 15.62,14.79 15.67,14.79 | 11.65,16.68 16.26,16.68 | R26.2 19.91,11.07 19.91,11.13 | R26.2 20.7,11.76 | R26.2 20.7,10.33 | 26.21,18.95 C57.1 | 26.26,18.91 26.21,18.95 | 26.26,18.91 26.26,18.95 26.21,18.95 | 26.21,17.43 R44.2 | 26.26,15.48 26.26,17.43 | 26.26,17.48 26.21,17.43 | 26.26,17.43 26.26,17.48 | C52.1 23.56,18.27 | C52.1 22.86,18.95 | C52.1 23.56,19.7 | C57.1 24.99,18.27 | C57.1 24.99,19.7 | 16.26,16.68 16.26,15.89 19.32,15.89 | 19.32,15.89 19.32,14.46 v19.59,14.46 | 19.32,15.89 20.07,15.89 | 19.32,15.89 19.32,16.68 | VCO2.11 26.29,10.33 | 14.51,38.27 20.68,38.27 | 20.68,38.27 R22.2 | R22.2 21.32,38.29 | R22.2 20.7,38.91 | 20.68,38.27 20.7,38.25 | R22.2 20.7,38.25 | 20.7,38.25 20.7,37.64 | R41.2 24.35,29.57 26.73,29.57 | R41.2 24.35,32.72 | R41.2 24.99,32.13 | R41.2 23.72,32.13 | C48.1 15.03,33.62 R31.2 | R31.2 18.32,33.62 | R31.2 17.57,34.3 | R31.2 17.57,32.88 17.69,32.88 | 26.26,18.27 26.26,18.91 | 26.26,17.43 26.21,17.43 | 26.26,17.48 26.26,18.27 | VCO2.11 26.29,11.57 | v38.48,40.97 VCO1.4 | v38.48,40.97 38.48,41.45 v40.7,43.67 v40.7,46.21 v40.7,48.43 | 57.72,1.29 C18.2
  Top 0.2: v61.18,27.95 62.3,29.07 65.47,29.07 65.95,28.59 v65.95,27.48 | T5.2 68.12,22.93 67.69,23.35 v67.69,26.68 67.69,28.52 R48.2 | v38.48,40.97 37.69,41.77 VCO1.5 | 56.26,11.76 IC3.5
  Top 0.4: v44.93,0.69 45.52,0.69 45.94,0.47 54.43,0.47 | 54.43,0.54 56.17,2.27
  Top 0.5: IC4.1 IC4.8 50.07,34.78 51.02,35.73 53.25,35.73 53.72,35.26 59.44,35.26 61.98,32.72 R2.2 63.56,32.72 64.99,31.29 68.8,31.29 v69.12,30.97 v72.93,30.97 | C16.2 61.82,13.67 61.27,13.12 C5.2 61.27,10.1 60.87,9.7 R6.2 C17.2 | 73.87,35.98 C4.2 | C16.2 59.37,14.71 58.8,14.14 | 58.8,14.14 58.48,14.46 56.58,14.46 56.26,14.14 56.26,11.76 55.47,10.97 54.04,10.97 53.19,10.12 53.19,9.13 52.17,8.11 v51.66,8.11 49.59,8.11 v45.63,12.08 C20.2 54.24,15.3 56.26,17.32 IC3.4 | C18.2 59.67,3.87 C15.2 C17.2 | C16.2 C14.2 64.11,14.94 65.89,14.94 C1.2 | 58.8,14.14 IC3.7 | C17.2 C11.2 | C6.2 70.23,5.57 69.44,6.37 69.44,8.43 | C2.2 73.09,11.45 72.77,11.13 C10.2 70.23,11.13 69.44,10.33 69.44,8.43 | 69.44,8.43 IC1.2 | 7.09,33.89 JP5.1 3.15,32.08 | 7.09,15.48 JP6.3 3.15,17.48 | 3.15,40.81 JP5.3 5.78,38.97 | 5.78,10.4 JP6.1 3.15,8.59 | 54.67,48.07 v54.67,48.12 | JP1.4 57.72,1.29 | T5.2
  Top 0.6: 56.17,2.27 57,2.27
  Top 0.8: v77.06,19.86 77.06,9.7 72.93,5.57 C6.2 71.1,4.21 69.91,3.03 63.72,3.03 JP1.4 | 60.23,42.88 59.76,43.35 56.58,43.35 55.95,42.72 55.95,38.12 55.31,37.48 R4.2 | C8.2 C7.2 52.61,43.67 | 60.23,42.88 IC2.2 60.23,41.13 60.71,40.66 v61.66,40.66 72.14,40.66 73.87,38.92 73.87,35.98 C3.2 v73.88,34.94 | 54.67,48.07 C13.2 53.29,44.35 52.61,43.67 | v63.09,48.5 63.09,45.73 60.23,42.88 | v40.7,43.67 52.61,43.67
  Top 0.965: v11.65,37.96 v11.65,36.84 | v11.65,13.35 v11.65,14.46
  Bottom 0.152: v38.8,1.13 39.1,0.64
  Bottom 0.2: v45.63,12.08 R39.2 | IC8.6 68.17,27.8 68.64,27.32 71.03,27.32 71.98,28.27 v71.98,44.46 71.98,45.55 69.97,47.55 R19.2 R11.1 C23.1 C24.2 R10.2 55.22,47.55 | 55.22,47.55 53.88,46.21 | 53.88,46.21 53.88,41.61 55.08,40.41 R18.2 58.24,40.18 IC9.4 61.18,40.18 v61.66,40.66 | C31.2 60.32,27.72 60.55,27.95 | IC8.6 68.17,31.38 C28.2 68.49,31.61 v69.12,30.97 | IC8.6 IC8.5 66.9,27.8 66.58,27.48 v65.95,27.48 66.74,26.68 v67.69,26.68 | IC6.14 56.26,16.68 57.53,15.41 | IC6.1 IC6.2 57.53,15.41 | 57.53,15.41 57.06,14.94 57.06,12.08 57.53,11.6 IC6.5 61.18,11.6 62.14,10.65 v62.77,10.65 C26.2 | 47.53,31.45 48.17,31.45 48.55,31.07 IC5.21 56.41,31.07 C21.2 61.1,30.74 61.5,30.34 61.5,28.27 v61.18,27.95 | IC5.5 47.15,31.83 47.53,31.45 | 47.53,31.45 47.53,30.65 47.16,30.28 IC5.3 | v35.78,15.41 36.58,15.41 v37.21,15.41 38.16,15.41 v38.48,15.1 40.07,15.1 v40.7,14.46 v40.7,12.4 v40.7,10.19 v40.7,8.75 v40.7,7.16 40.39,7.16 39.88,6.65 D5.1 | C35.2 C33.2 | C35.2 24.83,0.74 | C35.2 25.94,1.44 | C33.2 28.32,1.44 | C33.2 29.43,0.74 | v33.72,1.76 35.94,1.76 | v51.66,8.11 50.48,8.11 C25.2 | C60.1 C59.1 | C59.1 30.7,20.97 30.77,20.9 C64.2 | C60.1 28.16,25.46 v28.16,26.21 | C60.1 29.27,24.78 | C60.1 29.27,26.05 | C59.1 30.7,26.05 | C59.1 31.34,25.46 | C64.2 32.29,21.61 | C64.2 36.06,20.9 C63.1 | C63.1 35.31,21.92 | C63.1 36.1,21.92 | 36.1,21.92 36.1,22.72 35.62,22.72 35.62,24.46 IC14.2 37.69,24.46 | 36.1,21.92 36.74,21.92 | v11.65,7.79 v11.65,9.54 v11.65,10.97 v11.65,12.24 v11.65,13.35 v11.65,14.46 v12.61,14.46 v13.4,14.46 v15.62,14.46 v16.57,14.46 v17.53,14.46 v18.48,14.46 v19.59,14.46 v20.7,14.46 v21.81,14.46 v22.93,14.46 27.53,14.46 v27.85,14.14
  Bottom 0.2: 55.22,47.55 54.67,48.1 v54.67,48.12 | 23.88,21.61 23.36,21.09 C53.2 | X1.4 21.86,28.43 C54.1 | 23.88,21.61 25.15,21.61 26.26,21.49 | v11.65,24.62 12.13,25.1 | C54.1 22.61,30.02 | C54.1 21.86,30.65 21.97,30.65 | 21.34,27.95 22.29,27.95 | X1.4 21.34,27.95 | 21.34,26.37 X1.4 | 21.34,27.95 20.38,27.95 | 23.88,21.61 22.77,21.61 | C53.2 22.61,19.54 | C53.2 24.04,19.54 | v55.79,22.56 55.79,21.53 R38.2 C61.2 | R46.2 53.16,46.93 53.88,46.21 | R14.2 C27.2 70.16,16.68 IC7.1 65.69,16.68 v65.54,16.83 | v65.95,23.19 IC8.4 | v40.7,46.21 40.03,46.88 D6.1 | D6.1 36.61,46.88 | D6.1 v38.16,48.59 | D6.1 v38.16,45.26 | D5.1 38.16,5.5 | D5.1 36.45,6.65 | D5.1 38.16,8.11 | v44.93,0.69 43.58,1.32 S2.2 | v11.65,34.46 11.65,35.83 11.78,35.96
  Bottom 0.4: 42.89,0.64 S2.2
  Bottom 0.5: 36.58,17 34.99,17 | 36.58,15.41 36.58,17 | 36.58,17 38.01,17 | 36.58,17 36.58,18.27 | JP5.3 3.15,40.97 | JP5.1 JP5.3 | JP5.1 5.78,33.89 | JP5.1 3.15,31.92 | JP5.3 5.78,38.97 | 12.13,25.1 IC12.6 14.51,25.1 | JP6.1 JP6.3 | JP6.3 3.15,17.32 | JP6.1 3.15,8.43 | JP6.1 5.78,10.4 | JP6.3 5.78,15.48 | v61.18,27.95 60.55,27.95 | 39.1,0.64 42.89,0.64
  Bottom 0.8: v54.67,48.12 55.31,48.75 v63.09,48.5 | v77.06,19.86 77.06,22.4 72.93,26.53 v72.93,30.97 72.93,33.99 v73.88,34.94
  other vias: 31.97,15.41 30.23,14.46 31.97,12.87 22.93,45.26 22.93,47.8 22.93,42.72 30.7,37.64 29.43,36.37 30.7,33.83 29.27,43.67 2.6,5.41 2.6,24.62 35.78,33.83 37.21,34.78 35.78,37.64 34.2,39.38 35.62,47.8 33.09,47.8 33.09,45.26 35.62,45.26 34.36,43.67 31.81,43.67 33.24,37.64 34.67,35.89 31.97,35.89 31.97,39.38 33.09,33.83 40.7,35.89 40.7,38.59 40.7,41.13 38.32,26.68 39.44,27.64 39.91,32.56 36.26,43.67 33.4,26.53 35.62,26.53 30.54,45.26 30.54,47.8 28,47.8 33.24,40.5 25.46,45.26 25.46,47.8 28,45.26 26.73,43.67 25.46,42.72 24.2,40.66 20.38,42.72 20.38,45.26 20.38,47.8 12.77,47.8 12.77,45.26 12.77,42.72 10.22,42.72 10.22,45.26 10.22,47.8 15.3,47.8 17.84,47.8 17.84,45.26 15.3,42.72 17.84,42.72 15.3,45.26 16.57,40.66 11.5,40.66 10.22,39.38 8.96,40.66 15.62,39.23 20.07,26.05 18.28,24.94 16.57,24.94 13.08,31.77 13.4,33.51 16.89,34.94 15.62,34.94 14.51,34.94 13.4,34.94 18.16,34.94 19.43,34.94 20.54,34.94 21.65,34.94 22.77,34.94 23.72,37.96 22.77,37.96 21.65,39.07 21.65,37.96 20.7,39.38 19.59,39.07 19.59,37.96 12.61,16.05 10.22,16.05 10.22,17.95 10.22,19.7 12.61,17.95 14.51,17.95 14.51,16.05 15.62,17 9.27,24.62 10.22,22.72 10.7,14.46 9.69,14.46 9.91,9.54 13.08,8.11 13.4,9.54 13.4,11.45 15.3,9.54 15.3,7.48 15.3,4.94 12.77,4.94 5.94,14.46 6.79,14.46 7.58,14.46 7.69,16.05 3.88,17.48 2.6,17.48 2.6,20.02 5.14,17.48 5.94,16.84 2.6,8.27 3.88,8.27 5.14,8.27 5.94,9.06 5.94,11.45 6.89,11.45 7.84,11.45 8.8,11.45 7.69,7.48 5.14,5.73 7.69,4.94 24.83,37.96 18.8,32.24 15.62,37.96 16.89,37.96 15.62,33.51 18.16,37.96 17.37,17 18.48,17 17.84,9.54 17.84,7.48 17.84,4.94 17.84,2.24 15.3,2.24 12.77,2.24 7.84,2.24 9.91,11.45 24.83,7.48 26.26,9.12 22.93,9.54 21.81,11.45 21.81,10.33 22.93,7.48 22.93,2.24 22.93,4.94 25.94,5.19 28.32,2.49 30.23,11.6 29.12,13.03 25.94,2.49 33.24,11.6 31.97,10.33 33.56,14.46 38.22,22.56 37.53,20.97 29.75,20.97 32.29,22.56 29.75,22.56 26.2,26.99 28.16,17 2.6,22.56 2.6,26.68 2.6,29.22 2.6,31.77 3.88,31.77 5.94,34.94 5.94,32.72 5.14,40.97 2.6,40.97 2.6,42.72 2.6,44.46 5.14,44.15 5.14,42.72 7.69,42.72 6.57,40.66 7.84,39.38 9.91,34.94 9.91,33.51 10.7,30.02 10.22,31.77 7.53,34.94 5.14,26.68 5.14,29.54 5.14,24.62 5.14,22.56 5.14,19.7 10.22,26.53 7.84,47.8 7.69,45.26 3.88,40.97 36.42,2.08 37.05,3.67 38.8,3.67 33.24,4.3 40.7,5.73 33.26,16.96 40.7,16.37 40.7,18.11
  pour Top: 0.44,-0.87 0.29,49.58 41.29,49.58 41.44,-0.87
  pour Bottom: 0.44,0.13 0.94,49.63 41.94,49.63 41.44,0.13
IN  (via drill 0.33)
  Top 0.2: v38.8,2.4 JP3.2
  Bottom 0.2: IC10.3 36.42,0.81 38.01,2.4 v38.8,2.4
  Bottom 0.406: IC10.3
LE  (via drill 0.33 pad 0.25)
  Top 0.2: IC13.18 18.16,27.72 18.16,28.9 v17.86,29.2
  Bottom 0.2: IC5.12 50.17,36.75 49.59,37.32 44.83,37.32 40.7,33.19 40.7,32.24 37.21,28.75 34.2,28.75 33.72,29.22 27.21,29.22 24.35,32.08 20.23,32.08 18.16,30.02 17.86,29.72 v17.86,29.2
  Bottom 0.5: IC5.12
LOWBATT  (via drill 0.33)
  Top 0.2: R1.2 R2.1 64.84,32.72 63.56,33.99 61.98,33.99 59.91,36.05 56.26,36.05 v55.95,36.37
  Bottom 0.2: IC5.19 57.75,32.62 58.01,32.88 58.01,34.3 v55.95,36.37
  Bottom 0.5: IC5.19
MISO
  Bottom 0.152: 48.64,46.37 45.71,46.37 S1.1
  Bottom 0.2: IC5.16 53.29,45.53 52.45,46.37 48.64,46.37 44.04,41.77 44.04,39.86 JP2.1
  Bottom 0.5: IC5.16
MOSI
  Bottom 0.2: IC5.15 52.5,41.18 52.77,41.45 52.77,45.42 52.29,45.89 50.07,45.89 JP2.4
  Bottom 0.5: IC5.15
N$1  (via drill 3)
  other vias: 74.84,2.24
N$2  (via drill 3)
  other vias: 74.84,47.14
N$49  (via drill 0.33)
  other vias: 30.7,2.49
N$137  (via drill 0.33)
  other vias: 7.05,28.11
N$138  (via drill 0.33)
  other vias: 7.05,21.13
N$172  (via drill 3)
  other vias: 4.35,2.24
N$173  (via drill 3)
  other vias: 4.35,47.14
N$178  (via drill 0.33)
  other vias: 25.31,28.43
N$180  (via drill 0.33)
  other vias: 11.81,28.11
OSCIN  (via drill 0.33)
  Top 0.2: IC13.8 21.38,20.05 v20.86,19.54
  Bottom 0.2: X1.1 21.86,21.09 C53.1 v20.86,19.54
OUT
  Bottom 0.2: IC6.13 51.82,15.41 51.34,15.89 51.34,17 51.98,17.64 59.6,17.64 | 59.6,17.64 60.23,17 60.23,14.62 59.76,14.14 IC6.3 | 59.6,17.64 60.23,18.27 60.23,22.72 60.55,23.03 64.2,23.03 65.8,24.63 68.44,24.63 69.44,23.63 IC8.2 IC8.1
OUTA  (via drill 0.33)
  Top 0.2: 13.4,21.04 R29.2
  Top 0.5: v13.4,19.86 13.4,21.04
  Bottom 0.5: v13.4,19.86 IC12.8
OUTB  (via drill 0.33)
  Top 0.2: 13.4,28.2 R28.2
  Top 0.5: v13.4,29.38 13.4,28.2
  Bottom 0.5: IC12.5 v13.4,29.38
PCI12/ADC4/SDA/PC4
  Bottom 0.2: IC5.27 51.72,25.63 46.9,20.81 46.9,8.75 49.12,6.52 56.26,6.52 57.06,7.32 R15.1
PCI13/ADC5/SCL/PC5  (via drill 0.33)
  Top 0.2: v45.63,18.11 44.36,18.11 43.97,18.5 C62.1 41.74,18.5 40.55,19.7 28.16,19.7 24.63,23.24 R37.2 23.2,23.24 21.18,25.26 19.91,25.26 19.43,24.77 18.94,24.29 18.94,23.33 19.43,22.85 IC13.5
  Bottom 0.2: IC5.28 50.93,25.64 45.63,20.34 v45.63,18.11 R39.1
PCI23/AIN1/PD7  (via drill 0.33)
  Top 0.2: D4.1 76.9,32.58 76.9,27.8 75.95,26.84 75.31,26.84 71.98,30.18 68.64,30.18 68.17,30.65 62.93,30.65 59.12,34.46 v51.78,34.46
  Bottom 0.2: v51.78,34.46 49.91,34.46 49.38,35 49.38,35.63 IC5.11
  Bottom 0.5: IC5.11 49.38,35.63
PIN3
  Top 0.2: L6.1 8.64,36.43 | T2.3 C47.1 7.48,36.59 7.44,36.63 8.07,36.63 L6.1 | L6.1 8.64,36.05
RESET  (via drill 0.33)
  Top 0.2: C22.1 R7.2 46.81,37.55 JP2.5 | v48.96,42.4 42.29,42.4 41.66,41.77 41.66,26.84 42.94,25.56 42.94,22.98 44.13,21.8 v44.46,21.8
  Bottom 0.2: IC5.29 50.17,25.83 48.8,24.46 46.9,24.46 44.46,22.03 v44.46,21.8 | v48.96,42.4 48.96,39.7 JP2.5
SCK  (via drill 0.33)
  Top 0.2: v48.01,34.08 48.01,35.58 49.12,36.69 49.12,39.07 48.32,39.86 46.58,39.86 JP2.3
  Bottom 0.2: IC5.17 54.44,34.19 52.81,34.19 52.45,33.83 52.05,33.43 51.79,33.43 51.39,33.83 48.25,33.83 v48.01,34.08
  Bottom 0.5: 54.44,34.19 IC5.17
SDI
  Bottom 0.2: IC5.25 53.29,25.14 48.17,20.02 48.17,10.49 49.28,9.38 51.66,9.38 51.98,9.06 IC6.8
SIG$8
  Top 0.5: R6.1 56.44,9.93 | IC3.8 60.07,11.76 59.04,11.43 57.21,11.43 56.67,10.74 R6.1 | R5.2 56.42,9.45 R6.1
SIG$18
  Bottom 0.2: IC5.13 50.93,41.23 50.71,41.45 50.71,44.31 51.02,44.62 R8.1
  Bottom 0.5: IC5.13
SIG$19
  Bottom 0.2: R9.1 51.75,35.77 IC5.14
  Bottom 0.5: IC5.14
SIG$20
  Top 0.2: D4.2 R12.2
SIG$22
  Bottom 0.2: IC5.30 49.38,25.99 48.32,24.94 46.26,24.94 43.72,22.4 43.72,4.46 45.15,3.03 65.31,3.03 JP1.2
  Bottom 0.5: IC5.30
SIG$30
  Bottom 0.2: R13.2 73.72,18.27 74.52,17.48 74.52,14.3 74.13,13.91 R14.1 73.09,11.6 72.45,10.97 T1.1
SIG$31
  Bottom 0.2: T1.2 67.54,9.07 65.79,7.32 R15.2
SIG$34
  Bottom 0.2: C30.1 61.5,17.8 61.02,17.32 61.02,14.14 59.76,12.87 IC6.4
SIG$35
  Bottom 0.2: IC6.12 50.71,14.14 49.44,15.41 49.44,18.75 50.87,20.18 58.48,20.18 58.96,20.65 58.96,29.38 59.21,29.63 C29.1
SIG$37
  Bottom 0.2: C29.2 59.21,32.63 58.64,33.19 58.64,34.3 56.74,36.21 56.74,38.27 57.37,38.91 IC9.3 61.34,38.91 62.45,40.02 62.45,41.45 61.82,42.08 R17.1
SIG$39
  Bottom 0.2: 64.52,34.71 64.52,38.43 64.99,38.91 IC9.6 66.22,38.63 66.44,38.63 67.22,39.41 67.22,43.35 66.58,43.99 R19.1
  Bottom 0.406: R20.2 64.61,34.71 64.52,34.71
SIG$40
  Bottom 0.2: IC9.2 58.24,37.64 R18.1 58.01,35.58 58.8,34.78 R21.2
SIG$41  (via drill 0.33)
  Top 0.2: VCO2.2 v39.75,11.29 41.18,11.29 41.5,11.6 41.5,16.21 42.45,17.16 46.81,17.16 47.76,16.22 v50.55,16.22
  Bottom 0.2: IC9.1 61.98,36.37 62.52,35.82 R21.1 62.52,29.61 61.98,29.07 61.98,27.32 59.6,24.94 59.6,20.02 58.48,18.91 51.5,18.91 50.55,17.95 v50.55,16.22 | v39.75,11.29 38.6,11.29 D5.2
SIG$42  (via drill 0.33)
  Top 0.18: 51.7,49.59 67.26,49.59
  Top 0.2: v69.12,46.21 69.12,48.27 67.26,49.59 | VCO1.2 v39.75,34.78 | v46.87,45.71 51.7,49.59
  Bottom 0.2: v46.87,45.71 43.88,42.72 38.32,42.72 | v39.75,34.78 39.75,41.29 38.36,42.68 | 38.32,42.72 38.2,42.72 D6.2 38.36,42.68 | 38.36,42.68 38.32,42.72 | v69.12,46.21 69.09,46.18 69.09,39.98 66.75,37.64 IC9.7 66.78,37.64 67.64,36.78 67.64,34.66 R20.1
SIG$44
  Top 0.2: 30.74,27.71 L5.1 C32.1
  Top 0.3: 30.74,27.71 VCO1.14 | C32.1 C34.1
  Top 0.406: VCO1.14
SIG$45
  Top 0.2: IC11.4 29.12,26.69 29.59,26.21 30.54,26.21 31.18,25.57 L5.2
SIG$46
  Bottom 0.2: IC10.4 30.7,0.81 L4.2
  Bottom 0.406: IC10.4
SIG$48
  Top 0.2: IC11.3 29.11,23.99 29.75,23.35 36.74,23.35 38.01,24.62 JP4.2
SIG$51
  Top 0.2: T3.1 13.51,13.29 C39.1 14.51,12.94 C38.2
SIG$52  (1 unrouted)
  Top 0.2: 14.51,36.73 14.51,36.43 | T2.1 13.52,36.79 C37.1 14.87,36.43 C36.2
SIG$55
  Top 0.2: C46.1 7.83,13.29 L7.1 8.64,12.94 T3.3
SIG$56
  Top 0.2: L7.2 8.59,14.79 | C41.2 8.55,19.07
  Top 0.5: 8.59,14.79 C40.2 C41.2 | 8.55,19.07 C42.2 R29.1
SIG$57
  Top 0.152: L6.2 8.48,34.94 8.48,33.67 8.64,33.67
  Top 0.2: C43.1 8.64,31.92 | C45.1 8.59,28.11
  Top 0.5: 8.64,34.55 8.64,33.67 8.64,31.92 | C43.1 C44.1 8.59,28.11 R28.1
SIG$62  (via drill 0.33)
  Top 0.2: IC13.19 17.48,26.57 v17.83,26.22
  Bottom 0.2: IC5.9 45.16,35.74 41.98,32.56 41.98,31.92 37.85,27.8 33.88,27.8 33.4,28.27 26.73,28.27 23.88,31.13 21.02,31.13 19.91,30.02 19.91,27.16 19.11,26.37 18.96,26.22 v17.83,26.22
  Bottom 0.5: IC5.9
SIG$65
  Top 0.2: IC13.3 18.12,20.53 18.8,19.86 18.8,18.11 19.43,17.48 C49.2
SIG$66
  Top 0.2: C50.2 20.07,27.68 IC13.15
SIG$69
  Top 0.2: IC13.1 16.21,21.88 15.82,21.49 C51.2 C56.2 15.15,18.75 14.83,19.07 R32.2
SIG$70
  Top 0.2: C57.2 C52.2 R33.2 22.02,20.56 IC13.9
SIG$71
  Top 0.2: R34.2 15.42,27.75 16.53,28.86 C58.2 C55.2 17.37,31.13 18.77,29.72 IC13.17
SIG$72  (via drill 0.33)
  Top 0.2: 19.75,20.65 20.07,20.98 IC13.6 v20.07,23.34 v20.07,23.35 | 19.75,20.65 19.11,20.65 18.77,20.99 IC13.4 18.77,22.74 18.05,23.47 R32.1 R34.1 | R37.1 25.08,24.74 R36.1 25.15,23.83 v25.62,23.35 | 19.75,20.65 19.75,19.07 20.23,18.59 21.18,18.59 21.54,18.95 R33.1
  Bottom 0.2: R35.1 C59.2 C60.2 27.8,26.96 25.62,24.78 v25.62,23.35 v20.07,23.35
SIG$73
  Bottom 0.2: IC14.4 34.48,21.92 C63.2
SIG$76
  Top 0.2: C47.2 4.64,36.43 4.44,36.63 3.35,36.63 JP5.2
SIG$77
  Top 0.2: JP6.2 C46.2
SIG$78  (via drill 0.33)
  Top 0.2: v20.95,24.3 20.95,23.1 20.69,22.83 20.69,21.91 IC13.7
  Bottom 0.2: C54.2 23.36,28.43 X1.3 23.88,26.37 21.81,24.3 v20.95,24.3
SIG$79
  Top 0.5: C2.1 74.77,9.31 76.11,10.65 76.11,16.05 75.47,16.68 JP7.2 | C2.1 70.78,9.31 IC1.3 | C2.1 73.09,8.27 72.3,7.48 IC1.1
SIG$80
  Top 0.2: 20.44,36.43 R23.2 | R24.1 20.44,36.43 | R22.1 20.54,36.63 20.44,36.63 20.44,36.43
SIG$81
  Top 0.2: R27.2 20.07,12.57 R26.1 21.07,12.94 R25.1
SIG$82
  Top 0.2: C36.1 R24.2
SIG$83
  Top 0.152: R45.2 23.72,15.89 23.72,15.93
  Top 0.2: 23.4,15.93 23.36,15.89
  Top 0.8: R43.1 R44.1 23.72,15.93 23.4,15.93
SIG$84
  Top 0.2: 21.86,17.39 C49.1 21.86,17.48
  Top 0.5: R45.1 21.86,17.39 21.86,17.48
  Top 0.8: R30.1 R45.1
SIG$85
  Top 0.2: R42.2
  Top 0.8: R40.1 R41.1 R42.2
SIG$86
  Top 0.2: C50.1 | R31.1
  Top 0.8: C50.1 R42.1 | R31.1 C50.1
SIG$87
  Top 0.2: C38.1 R27.1
SIG$88
  Bottom 0.2: R46.1 49.64,48.23 S1.2
SIG$90  (via drill 0.33)
  Top 0.152: T5.1 69.44,24.78 69.44,28.59
  Top 0.2: R48.1 69.44,28.59 | 69.44,28.59 68.96,28.11 T5.1 | 69.44,28.59 67.85,30.18 62.45,30.18 59.28,33.35 51.35,33.35 v51.03,33.04
  Bottom 0.2: v51.03,33.04 47.69,33.04 47.32,33.4 IC5.7
SW
  Top 0.5: D3.1 50.07,24.78 48.48,26.37 48.48,30.18 48.8,30.5 IC4.7 L3.2
SW1
  Top 0.2: L2.2
  Top 0.5: D2.1 L2.2 53.56,13.19 57.53,17.16 IC3.3
TRIG
  Bottom 0.2: C26.1 67.85,10.65 68.49,10.02 T1.3 69.55,11.56 70.23,12.24 70.87,12.24 71.66,13.03 71.66,14.78 71.03,15.41 IC7.2 64.68,15.41 64.2,15.89 | 64.2,15.89 64.2,19.7 66.13,21.63 67.44,21.63 68.17,22.36 IC8.3 | 64.2,15.89 63.72,15.41 IC7.7 IC7.6
VCC  (via drill 0.33)
  Top 0.2: v30.7,4.94 30.7,6.05 VCO2.14
  Top 0.406: VCO2.14
  Bottom 0.2: C35.1 C33.1 L4.1 v30.7,4.94
VCO1_DCADJ
  Bottom 0.2: R16.2 63.88,42.56 64.2,42.88 R11.2 C23.2 60.32,46.21 55.31,46.21 54.75,45.65 R8.2
VCO1_OUT
  Top 0.2: 26.29,36.37 VCO1.10 23.99,36.43 | R40.2 23.99,36.43 | 23.99,36.43 R23.1
VCO2_DCADJ
  Bottom 0.2: R10.1 C24.1 59.12,42.4 58.8,42.08 R17.2 56.74,42.08 56.1,42.72 R9.2
VCO2_OUT
  Top 0.2: R25.2 24,12.94 R43.2 24.35,12.94 VCO2.10
VIN  (via drill 0.33 pad 0.25)
  Top 0.2: R1.1 73.64,32.72 C3.1
  Top 0.5: 63.88,37.96 L1.1 68.33,37.96 | 53.72,25.41 L3.1 | IC4.2 46.1,30.5 47.21,29.38 47.21,23.86 48.2,22.88 51.18,22.88 | IC3.2 58.8,17.32 59.44,16.68 61.5,16.68 61.82,17 C16.1 C14.1 66.02,17.71 68.96,20.65 71.82,20.65 72.3,20.18 | IC3.2 IC3.1 | IC3.2 58.8,19.7 58.48,20.02 55.47,20.02 53.72,18.27 L2.1 51.18,18.43 51.18,22.88 | C4.1 69.99,38.98 68.96,37.96 68.33,37.96 | 68.96,37.32 68.33,37.96 | JP7.1 C1.1 71.56,17.69 72.3,18.43 72.3,20.18 | T4.3 75.45,21.58 74.04,20.18 72.3,20.18 | 51.18,22.88 51.68,22.88 52.44,23.63 52.44,24.13 53.72,25.41 | IC4.6 50.85,29.22 51.44,28.63 51.44,27.7 53.72,25.41
  Top 0.7: IC2.4 IC2.5 62.45,39.38 63.88,37.96
  Top 0.8: 68.96,37.32 68.96,36.21 70.55,34.62 72.45,34.62 73.88,33.19 C3.1 73.88,32.19 74.44,31.63 74.44,28.99 74.62,28.81 | 74.62,28.81 v75.47,27.95 74.62,28.81 | v75.47,25.73 75.47,23.53 T4.3 | 74.62,28.81
  Bottom 0.8: v75.47,25.73 v75.47,27.95
VOUT
  Bottom 0.2: C64.1 R35.2 34.48,25.46 IC14.5
(copper drawn outside any net)
  shapes: Bottom area x4, Bottom circle x4, Top area x30, Top circle x2

## Text on the board
tPlace: 3 | 2 | 1 | 3 | 2 | 1 | 3 | 2 | 1 | TOP
bPlace: BOTTOM